# EAGLE design freezeTime (EAGLE 7.1.0)
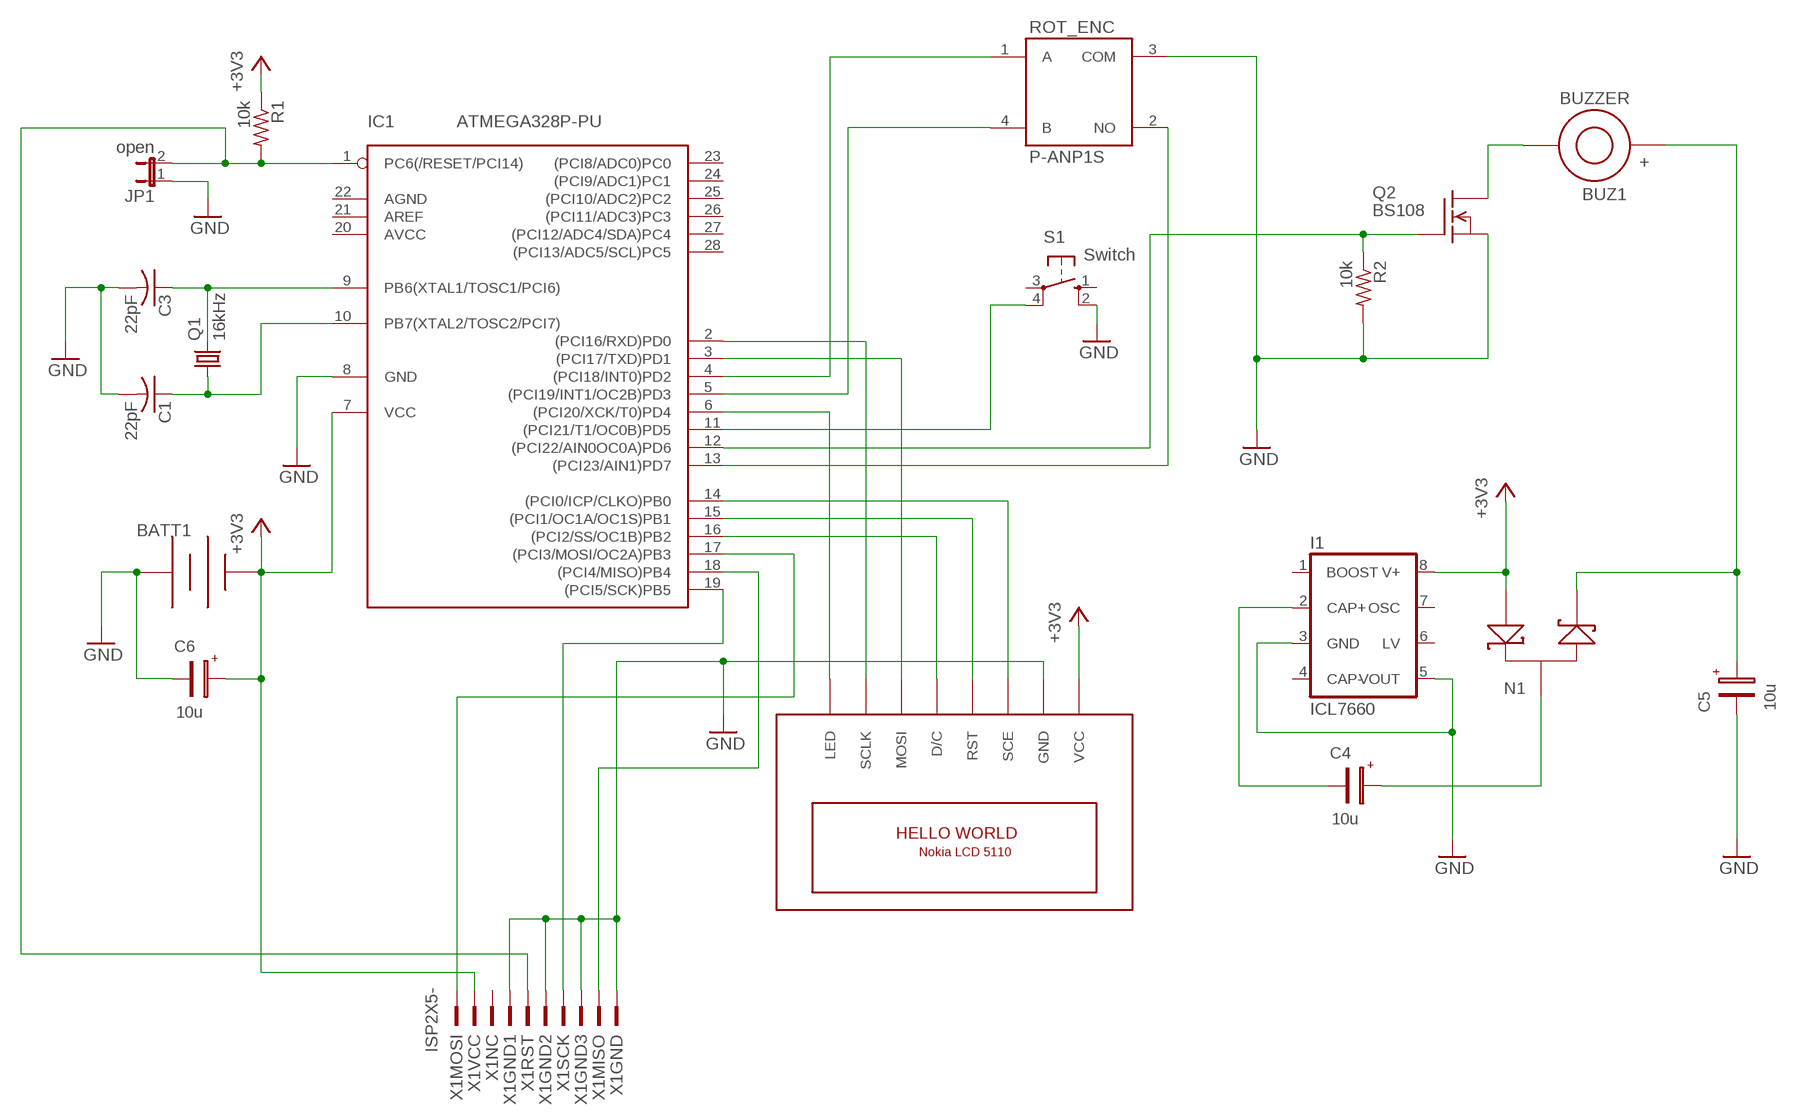
[diagram p0: schematic, sheet 1]

## Parts
BATT1  3VBATTERY  [BH241-3A]
BUZ1  BUZZER  [AL1210MTE-P5R]
C1  22pF  C-USC1206  [C1206]
C3  22pF  C-USC1206  [C1206]
C4  10u  C-TANCTS  [C/6032-28R]
C5  10u  C-TANCTS  [C/6032-28R]
C6  10u  C-TANCTS  [C/6032-28R]
I1  ICL7660  ICL7660S7660SCBA  [SO08]
IC1  ATMEGA328P-PU  ATMEGA168-20P  [DIL28-3]
JP1  open  JP1E  [JP1]
LCD1  LCD_NOKIA5110  [LCD_NOKIA5110]
N1  BAT54S  BAT54SBAT54S  [SOT23]
Q1  16kHz  CRYSTALHC49U70  [HC49U70]
Q2  BS108  FQN1N50CI  [TO92-INLINE]
R1  10k  R-US_R1206  [R1206]
R2  10k  R-US_R1206  [R1206]
ROT_ENC  P-ANP1S  P-ANP1SP-ANP1S  [P-ANP1S]
S1  Switch  SPST_SWITCH  [TACTS-24N]
X1  ISP2X5-  [PAK100/2500-10]

## Nets
+3V3: BATT1.+ C6.+ I1.8(V+) IC1.7(VCC) LCD1.P$1(VCC) N1.1 R1.1 X1.2
GND: BATT1.- C1.2 C3.2 C5.- C6.- I1.3(GND) I1.5(VOUT) IC1.8(GND) JP1.1 LCD1.P$2(GND) Q2.3(S) R2.2 ROT_ENC.3(COM) S1.2(S1) X1.4 X1.6 X1.8 X1.10
N$1: C3.1 IC1.9(PB6(XTAL1/TOSC1/PCI6)) Q1.2
N$2: C1.1 IC1.10(PB7(XTAL2/TOSC2/PCI7)) Q1.1
N$3: IC1.13((PCI23/AIN1)PD7) ROT_ENC.2(NO)
N$4: IC1.1(PC6(/RESET/PCI14)) JP1.2 R1.2 X1.5
N$5: IC1.4((PCI18/INT0)PD2) ROT_ENC.1(A)
N$6: IC1.18((PCI4/MISO)PB4) X1.9
N$7: IC1.5((PCI19/INT1/OC2B)PD3) ROT_ENC.4(B)
N$8: IC1.15((PCI1/OC1A/OC1S)PB1) LCD1.P$4(RST)
N$9: IC1.14((PCI0/ICP/CLKO)PB0) LCD1.P$3(SCE)
N$10: IC1.16((PCI2/SS/OC1B)PB2) LCD1.P$5(D/C)
N$11: IC1.17((PCI3/MOSI/OC2A)PB3) X1.1
N$12: IC1.11((PCI21/T1/OC0B)PD5) S1.4(P1)
N$13: IC1.6((PCI20/XCK/T0)PD4) LCD1.P$8(LED)
N$14: BUZ1.2 Q2.1(D)
N$15: IC1.19((PCI5/SCK)PB5) X1.7
N$16: IC1.12((PCI22/AIN0OC0A)PD6) Q2.2(G) R2.1
N$20: C4.- I1.2(CAP+)
N$21: C4.+ N1.3
N$22: BUZ1.1(+) C5.+ N1.2
N$23: IC1.3((PCI17/TXD)PD1) LCD1.P$6(MOSI)
N$24: IC1.2((PCI16/RXD)PD0) LCD1.P$7(SCLK)
Unconnected: I1.1(BOOST) I1.4(CAP-) I1.6(LV) I1.7(OSC) IC1.20(AVCC) IC1.21(AREF) IC1.22(AGND) IC1.23((PCI8/ADC0)PC0) IC1.24((PCI9/ADC1)PC1) IC1.25((PCI10/ADC2)PC2) IC1.26((PCI11/ADC3)PC3) IC1.27((PCI12/ADC4/SDA)PC4) IC1.28((PCI13/ADC5/SCL)PC5) S1.1(S) S1.3(P) X1.3

## Library data of the parts
BATT1 = lisakovo:3VBATTERY: 3V battery - dual package
BUZ1 = lisakovo:BUZZER
C1 C3 = adafruit:C-US: CAPACITOR, American symbol
C4-C6 = lisakovo:C-TAN: Tantal capacitor
I1 = lisakovo:ICL7660S: ICL7660A DC-DC inverter / charge pump
IC1 = adafruit:ATMEGA168*P: MICROCONTROLLER 16 kBytes FLASH 1 kBytes SRAM 512 Bytes EEPROM USART 8-channel 10 bit ADC
JP1 = lisakovo:JP1E: JUMPER
LCD1 = lisakovo:LCD_NOKIA5110
N1 = lisakovo:BAT54S: BAT54S Schottky Barrier Diodes; GME: 920-103
Q1 = adafruit:CRYSTAL: CRYSTAL; OC_FARNELL: unknown; OC_NEWARK: unknown
Q2 = adafruit:FQN1N50C: N-Channel Enhancement MOSFET 500V, 0.4A, 6.0 Ohm
R1 R2 = adafruit:R-US_: RESISTOR, American symbol
ROT_ENC = lisakovo:P-ANP1S
S1 = lisakovo:SPST_SWITCH: SPST push button switch; GME: 631-400; MF: NINIGI
X1 = lisakovo:ISP2X5-: Arduino 2x5 ISP MLW10G; GME: 800-035; MF: 3M; MPN: 2510-6002UB; OC_FARNELL: 9838244; OC_NEWARK: 46F4725

## Net classes
0 default: width 0.381 mm, clearance 0.305 mm

## Board
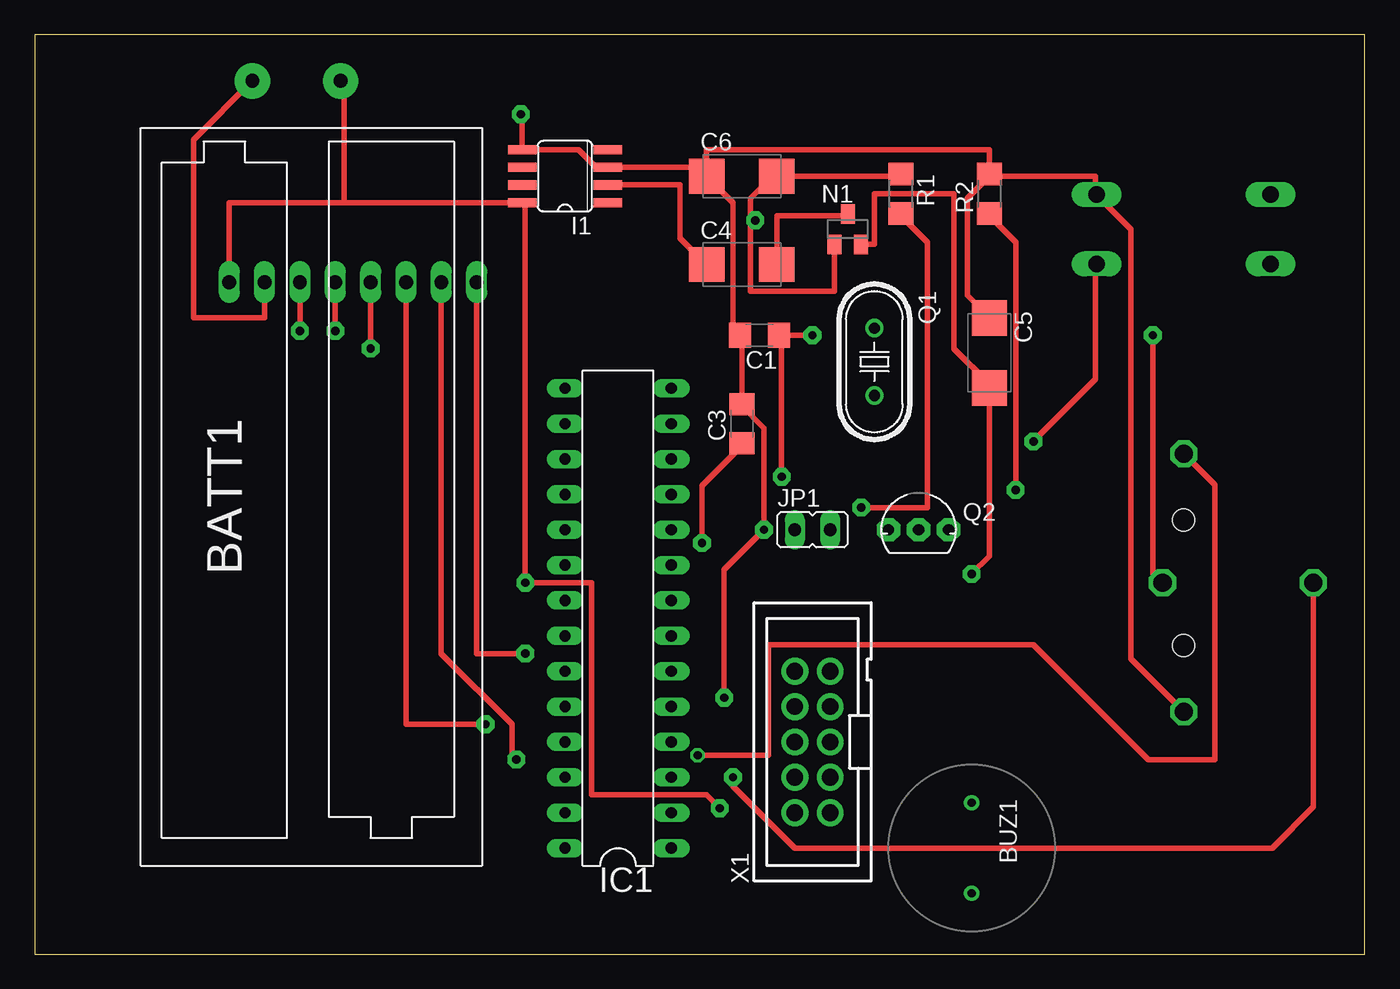
[diagram p1: board, top side]
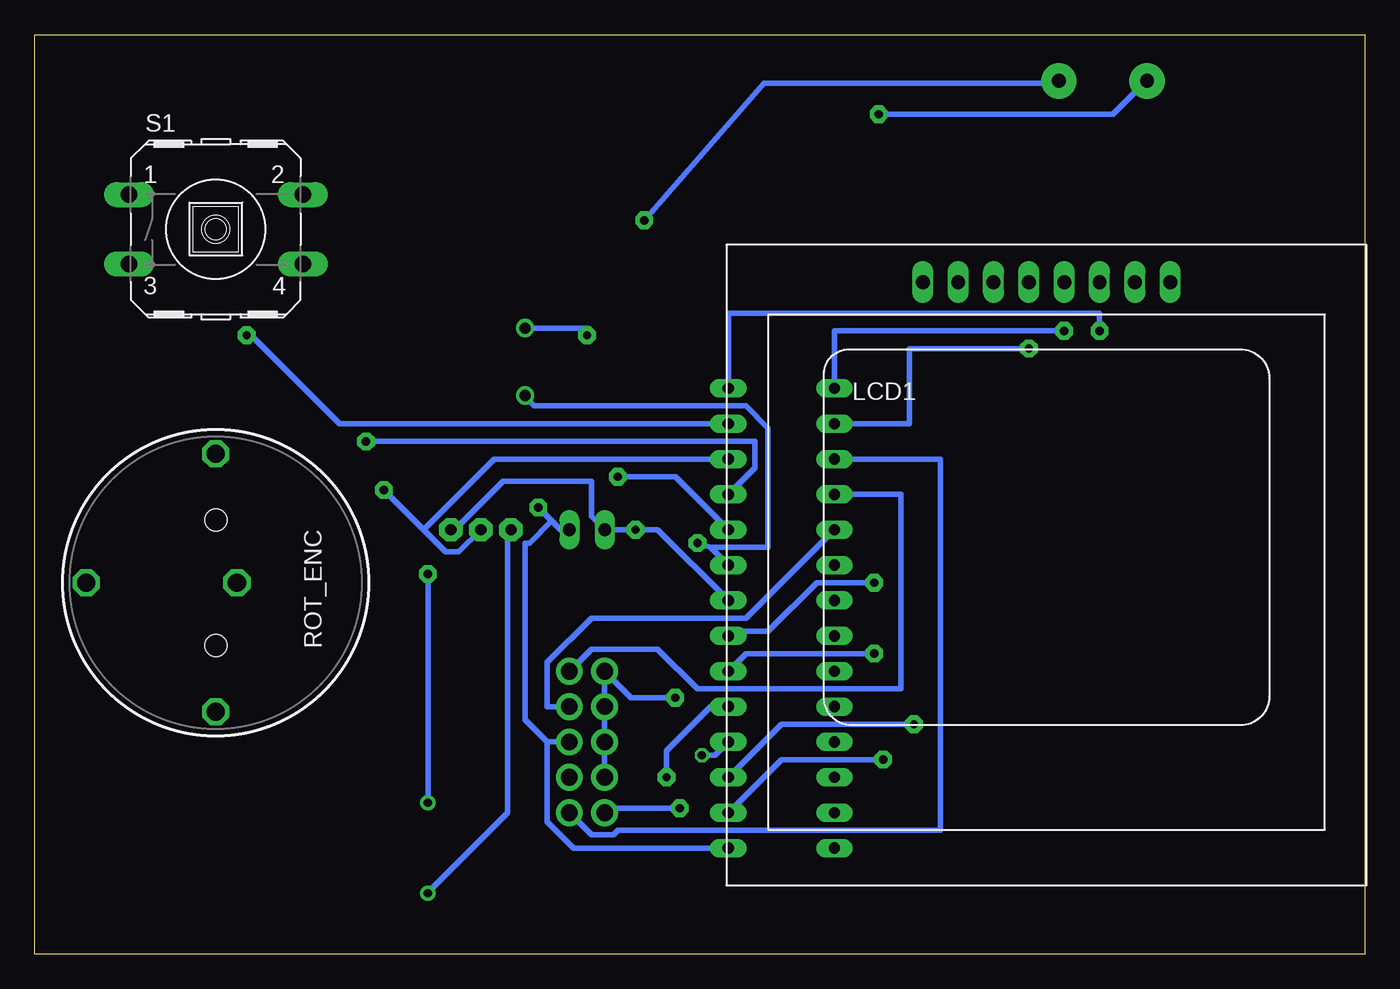
[diagram p2: board, bottom side, seen from below]

Size 95.56 x 66.03 mm. Coordinates in mm from the lower left corner, seen from the top.
Outline: 0,0 95.56,0 95.56,66.03 0,66.03 0,0
Copper layers (1*16): Top 0.035mm / dielectric 1.5mm / Bottom 0.035mm
Design rules "default *": minimum track width 10mil, minimum drill 0.6mm, track to track 12mil, track to pad 12mil, pad to pad 12mil, via to via 12mil, smd to smd 8mil, copper to edge 40mil, drill to drill 8mil, minimum pad ring 10mil, minimum via ring 8mil, stop-mask expansion 4mil, vias tented up to drill 0mil, thermal gap 10mil
tRestrict: area 53.3,25.4 to 58.4,38.1
vRestrict: area 51.4,21.6 to 60.3,41.9

### Footprints (pad centres in the part's own frame; a part is rotated, then mirrored left to right if it is on the bottom)
BH241-3A = drill 1 pad 2.54: + 56.365,-14.35; - 56.365,-8.015
AL1210MTE-P5R = drill 0.6: 1 -3.25,0; 2 3.25,0
C1206 = smd 1.6 x 1.8: 1 -1.4,0; 2 1.4,0
C/6032-28R = smd 2.55 x 2.5: + 2.525,0; - -2.525,0
SO08 = smd 0.66 x 2.032: 1 -1.905,-3.073; 2 -0.635,-3.073; 3 0.635,-3.073; 4 1.905,-3.073; 5 1.905,3.073; 6 0.635,3.073; 7 -0.635,3.073; 8 -1.905,3.073
DIL28-3 = drill 0.813 long: 1 -16.51,-3.81; 2 -13.97,-3.81; 3 -11.43,-3.81; 4 -8.89,-3.81; 5 -6.35,-3.81; 6 -3.81,-3.81; 7 -1.27,-3.81; 8 1.27,-3.81; 9 3.81,-3.81; 10 6.35,-3.81; 11 8.89,-3.81; 12 11.43,-3.81; 13 13.97,-3.81; 14 16.51,-3.81; 15 16.51,3.81; 16 13.97,3.81; 17 11.43,3.81; 18 8.89,3.81; 19 6.35,3.81; 20 3.81,3.81; 21 1.27,3.81; 22 -1.27,3.81; 23 -3.81,3.81; 24 -6.35,3.81; 25 -8.89,3.81; 26 -11.43,3.81; 27 -13.97,3.81; 28 -16.51,3.81
JP1 = drill 0.914 long: 1 0,-1.27; 2 0,1.27
LCD_NOKIA5110 = drill 1 long: P$1 8.89,20.32; P$2 6.35,20.32; P$3 3.81,20.32; P$4 1.27,20.32; P$5 -1.27,20.32; P$6 -3.81,20.32; P$7 -6.35,20.32; P$8 -8.89,20.32
SOT23 = smd 1 x 1.4: 1 -0.95,-1.1; 2 0.95,-1.1; 3 0,1.1
HC49U70 = drill 0.813: 1 -2.413,0; 2 2.413,0
TO92-INLINE = drill 0.813 pad 1.676 octagon: 1 -2.159,0; 2 0,0; 3 2.159,0
R1206 = smd 1.6 x 1.803: 1 -1.422,0; 2 1.422,0
P-ANP1S = drill 1.3 octagon: 1 -9.26,0; 2 0,1.52; 3 9.26,0; 4 0,-9.31 | hole 1.6: -4.5,0; 4.5,0
TACTS-24N = drill 1.194 long: 1 -6.248,2.489; 2 6.248,2.489; 3 -6.248,-2.489; 4 6.248,-2.489
PAK100/2500-10 = drill 1.2 pad 1.93: 1 -5.08,-1.27; 2 -5.08,1.27; 3 -2.54,-1.27; 4 -2.54,1.27; 5 0,-1.27; 6 0,1.27; 7 2.54,-1.27; 8 2.54,1.27; 9 5.08,-1.27; 10 5.08,1.27

### Placement (x,y rotation side)
BATT1  7.62,6.35 90 top
BUZ1  67.31,7.62 270 top
C1  52.07,44.45 180 top
C3  50.8,38.1 90 top
C4  50.8,49.53 0 top
C5  68.58,43.18 270 top
C6  50.8,55.88 0 top
I1  38.1,55.88 90 top
IC1  41.91,24.13 90 top
JP1  55.88,30.48 270 top
LCD1  22.86,27.94 0 bottom
N1  58.42,52.07 0 top
Q1  60.33,42.55 270 top
Q2  63.5,30.48 0 top
R1  62.23,54.61 270 top
R2  68.58,54.61 90 top
ROT_ENC  82.55,26.67 270 bottom
S1  82.55,52.07 0 bottom
X1  55.88,15.24 90 top

### Tracks (layer width: path | path; a pad name or v marks a point on that pad's centre or on a via)
+3V3  (via drill 0.6 pad 1.27)
  Top 0.381: 57.47,50.8 N1.1 57.47,47.62 51.44,47.62 51.44,53.34 51.44,54.29 53.02,55.88 C6.+ 62.23,55.88 R1.1 | BATT1.+ 22.23,62.55 22.23,53.98 I1.8 35.24,53.98 v35.24,26.67 40.01,26.67 40.01,11.43 46.99,11.43
  Top 0.406: v51.75,52.7 51.44,52.7 51.44,53.34 | 46.99,11.43 48.26,11.43 v49.21,10.48 | 22.23,53.98 13.97,53.98 LCD1.P$1
  Bottom 0.381: IC1.7 45.4,23.18 42.86,23.18 39.37,26.67 v35.24,26.67 | X1.2 54.29,10.48 v49.21,10.48 | v51.75,52.7 43.18,62.55 22.23,62.55 BATT1.+
GND  (via drill 0.6 pad 1.27)
  Top 0.381: 68.58,55.88 76.2,55.88 76.2,54.61 S1.2 76.52,54.29 78.74,52.07 78.74,21.22 ROT_ENC.3 82.55,17.46 | 68.58,55.88 66.99,54.29 66.99,47.31 68.58,45.72 C5.- | 68.58,55.88 R2.2 68.58,57.78 48.26,57.78 48.26,56.52 | 48.26,56.52 I1.3 40.32,56.52 39.05,57.78 I1.5 | 48.26,56.52 C6.- | C6.- 48.58,55.88 48.58,55.56 50.16,53.98 50.16,44.45 C1.2 50.8,44.45 C3.2 50.8,39.37 52.39,37.78 v52.39,30.48 49.53,27.62 v49.53,18.41 | 34.92,57.78 I1.5 | 48.26,56.52 C6.- | v34.92,60.33 35.03,60.22 I1.5
  Top 0.406: BATT1.- 11.43,58.51 11.43,45.72 16.51,45.72 LCD1.P$2
  Bottom 0.381: IC1.8 50.8,30.48 v52.39,30.48 JP1.1 | 55.56,33.97 61.91,33.97 65.41,30.48 Q2.3 | X1.4 X1.6 X1.8 X1.10 | 15.88,62.55 BATT1.-
  Bottom 0.406: 55.56,33.97 55.56,31.43 JP1.1 | v49.53,18.41 52.7,18.41 X1.10 | 15.88,62.55 18.1,60.33 v34.92,60.33
N$1  (via drill 0.6 pad 1.27)
  Top 0.381: v47.94,29.53 47.94,33.66 50.8,36.51 C3.1
  Bottom 0.381: IC1.9 46.99,29.21 | 46.99,29.21 v47.94,29.53 | 46.99,29.21 42.86,29.21 42.86,37.78 44.45,39.37 59.69,39.37 60.33,40.01 Q1.2
N$2  (via drill 0.6 pad 1.27)
  Top 0.381: v55.88,44.45 53.66,44.45 | 53.66,44.45 C1.1 | 53.66,44.45 v53.66,34.29
  Bottom 0.381: IC1.10 49.53,34.29 v53.66,34.29 | v55.88,44.45 55.88,44.96 Q1.1
N$3  (via drill 0.6 pad 1.27)
  Top 0.381: v80.33,44.45 80.33,27.3 80.96,26.67 ROT_ENC.2
  Bottom 0.406: IC1.13 73.66,38.1 80.01,44.45 v80.33,44.45
N$4  (via drill 0.6 pad 1.27)
  Top 0.381: R1.2 62.23,53.02 64.14,51.12 64.14,32.07 v59.37,32.07
  Bottom 0.381: IC1.1 56.83,7.62 58.74,9.53 58.74,15.24 | X1.5 58.74,15.24 | 58.42,31.11 57.78,30.48 JP1.2 | 58.74,15.24 60.33,16.83 60.33,29.53 60.01,29.53 58.42,31.11 | 58.42,31.11 v59.37,32.07
N$5  (via drill 0.6 pad 1.02)
  Top 0.381: 82.55,35.88 ROT_ENC.1 84.77,33.71 84.77,13.97 80.01,13.97 71.75,22.23 52.7,22.23 52.7,14.29 v47.62,14.29
  Bottom 0.381: IC1.4 46.67,14.29 v47.62,14.29
N$6
  Bottom 0.381: 33.34,30.16 33.34,19.05 47.94,19.05 50.8,21.91 55.56,21.91 X1.9
  Bottom 0.406: 33.34,30.16 33.34,33.02 IC1.18
N$7  (via drill 0.6 pad 1.27)
  Top 0.381: v50.16,12.7 50.16,12.06 54.61,7.62 88.9,7.62 91.86,10.58 ROT_ENC.4
  Bottom 0.406: IC1.5 46.99,17.78 50.16,14.61 v50.16,12.7
N$8  (via drill 0.6 pad 1.27)
  Top 0.381: LCD1.P$4 v21.59,44.77
  Bottom 0.381: v21.59,44.77 33.97,44.77
  Bottom 0.406: 33.97,44.77 38.1,44.77 IC1.15
N$9  (via drill 0.6 pad 1.27)
  Top 0.381: LCD1.P$3 v19.05,44.77
  Bottom 0.406: IC1.14 45.72,46.04 19.05,46.04 v19.05,44.77
N$10  (via drill 0.6 pad 1.27)
  Top 0.381: LCD1.P$5 v24.13,43.5
  Bottom 0.381: v24.13,43.5 32.7,43.5
  Bottom 0.406: 32.7,43.5 32.7,38.1 IC1.16
N$11
  Bottom 0.381: 30.48,30.48 30.48,8.89 53.66,8.89 53.98,8.57 55.56,8.57 X1.1
  Bottom 0.406: 30.48,30.48 30.48,35.56 IC1.17
N$12  (via drill 0.6 pad 1.27)
  Top 0.381: v71.75,36.83 76.2,41.27 76.2,49.53 S1.4
  Bottom 0.381: IC1.11 43.81,34.92 43.81,36.83 v71.75,36.83
N$13  (via drill 0.6 pad 1.27)
  Top 0.381: LCD1.P$8 31.75,26.67 31.75,26.35
  Top 0.406: 35.56,21.59 v35.24,21.59 31.75,21.59 31.75,26.67
  Bottom 0.381: IC1.6 44.45,21.59 v35.24,21.59
N$14
  Bottom 0.381: BUZ1.2 67.31,4.45 61.59,10.16 61.59,30.48 Q2.1
N$15
  Bottom 0.381: IC1.19 44.45,24.13 55.56,24.13 58.74,20.95 58.74,17.78 X1.7
N$16  (via drill 0.6 pad 1.27)
  Top 0.381: v70.48,33.34 70.48,51.12 68.58,53.02 R2.1
  Bottom 0.381: 67.63,30.48 66.04,28.89 65.09,28.89 Q2.2 | 67.63,30.48 v70.48,33.34 | IC1.12 62.55,35.56 67.63,30.48
N$20
  Top 0.381: I1.2 46.35,55.24 46.35,51.44 C4.-
N$21
  Top 0.381: N1.3 58.42,53.02 53.34,53.02 53.34,49.53 C4.+
N$22  (via drill 0.6 pad 1.27)
  Top 0.381: 59.37,51.12 N1.2 60.33,50.97 60.33,54.61 66.04,54.61 66.04,43.5 68.58,40.96 C5.+ 68.58,29.84
  Top 0.406: 68.58,29.84 68.58,28.57 v67.31,27.3
  Bottom 0.381: v67.31,27.3 BUZ1.1
N$23  (via drill 0.6 pad 1.27)
  Top 0.406: v32.38,16.51 26.67,16.51 LCD1.P$6
  Bottom 0.381: IC1.3 41.91,16.51 v32.38,16.51
N$24  (via drill 0.6 pad 1.27)
  Top 0.381: LCD1.P$7 29.21,21.59
  Top 0.406: 29.21,21.59 34.29,16.51 34.29,13.97 v34.61,13.97
  Bottom 0.381: IC1.2 41.91,13.97 v34.61,13.97